# EAGLE schematic Instruments (EAGLE 9.2.2)
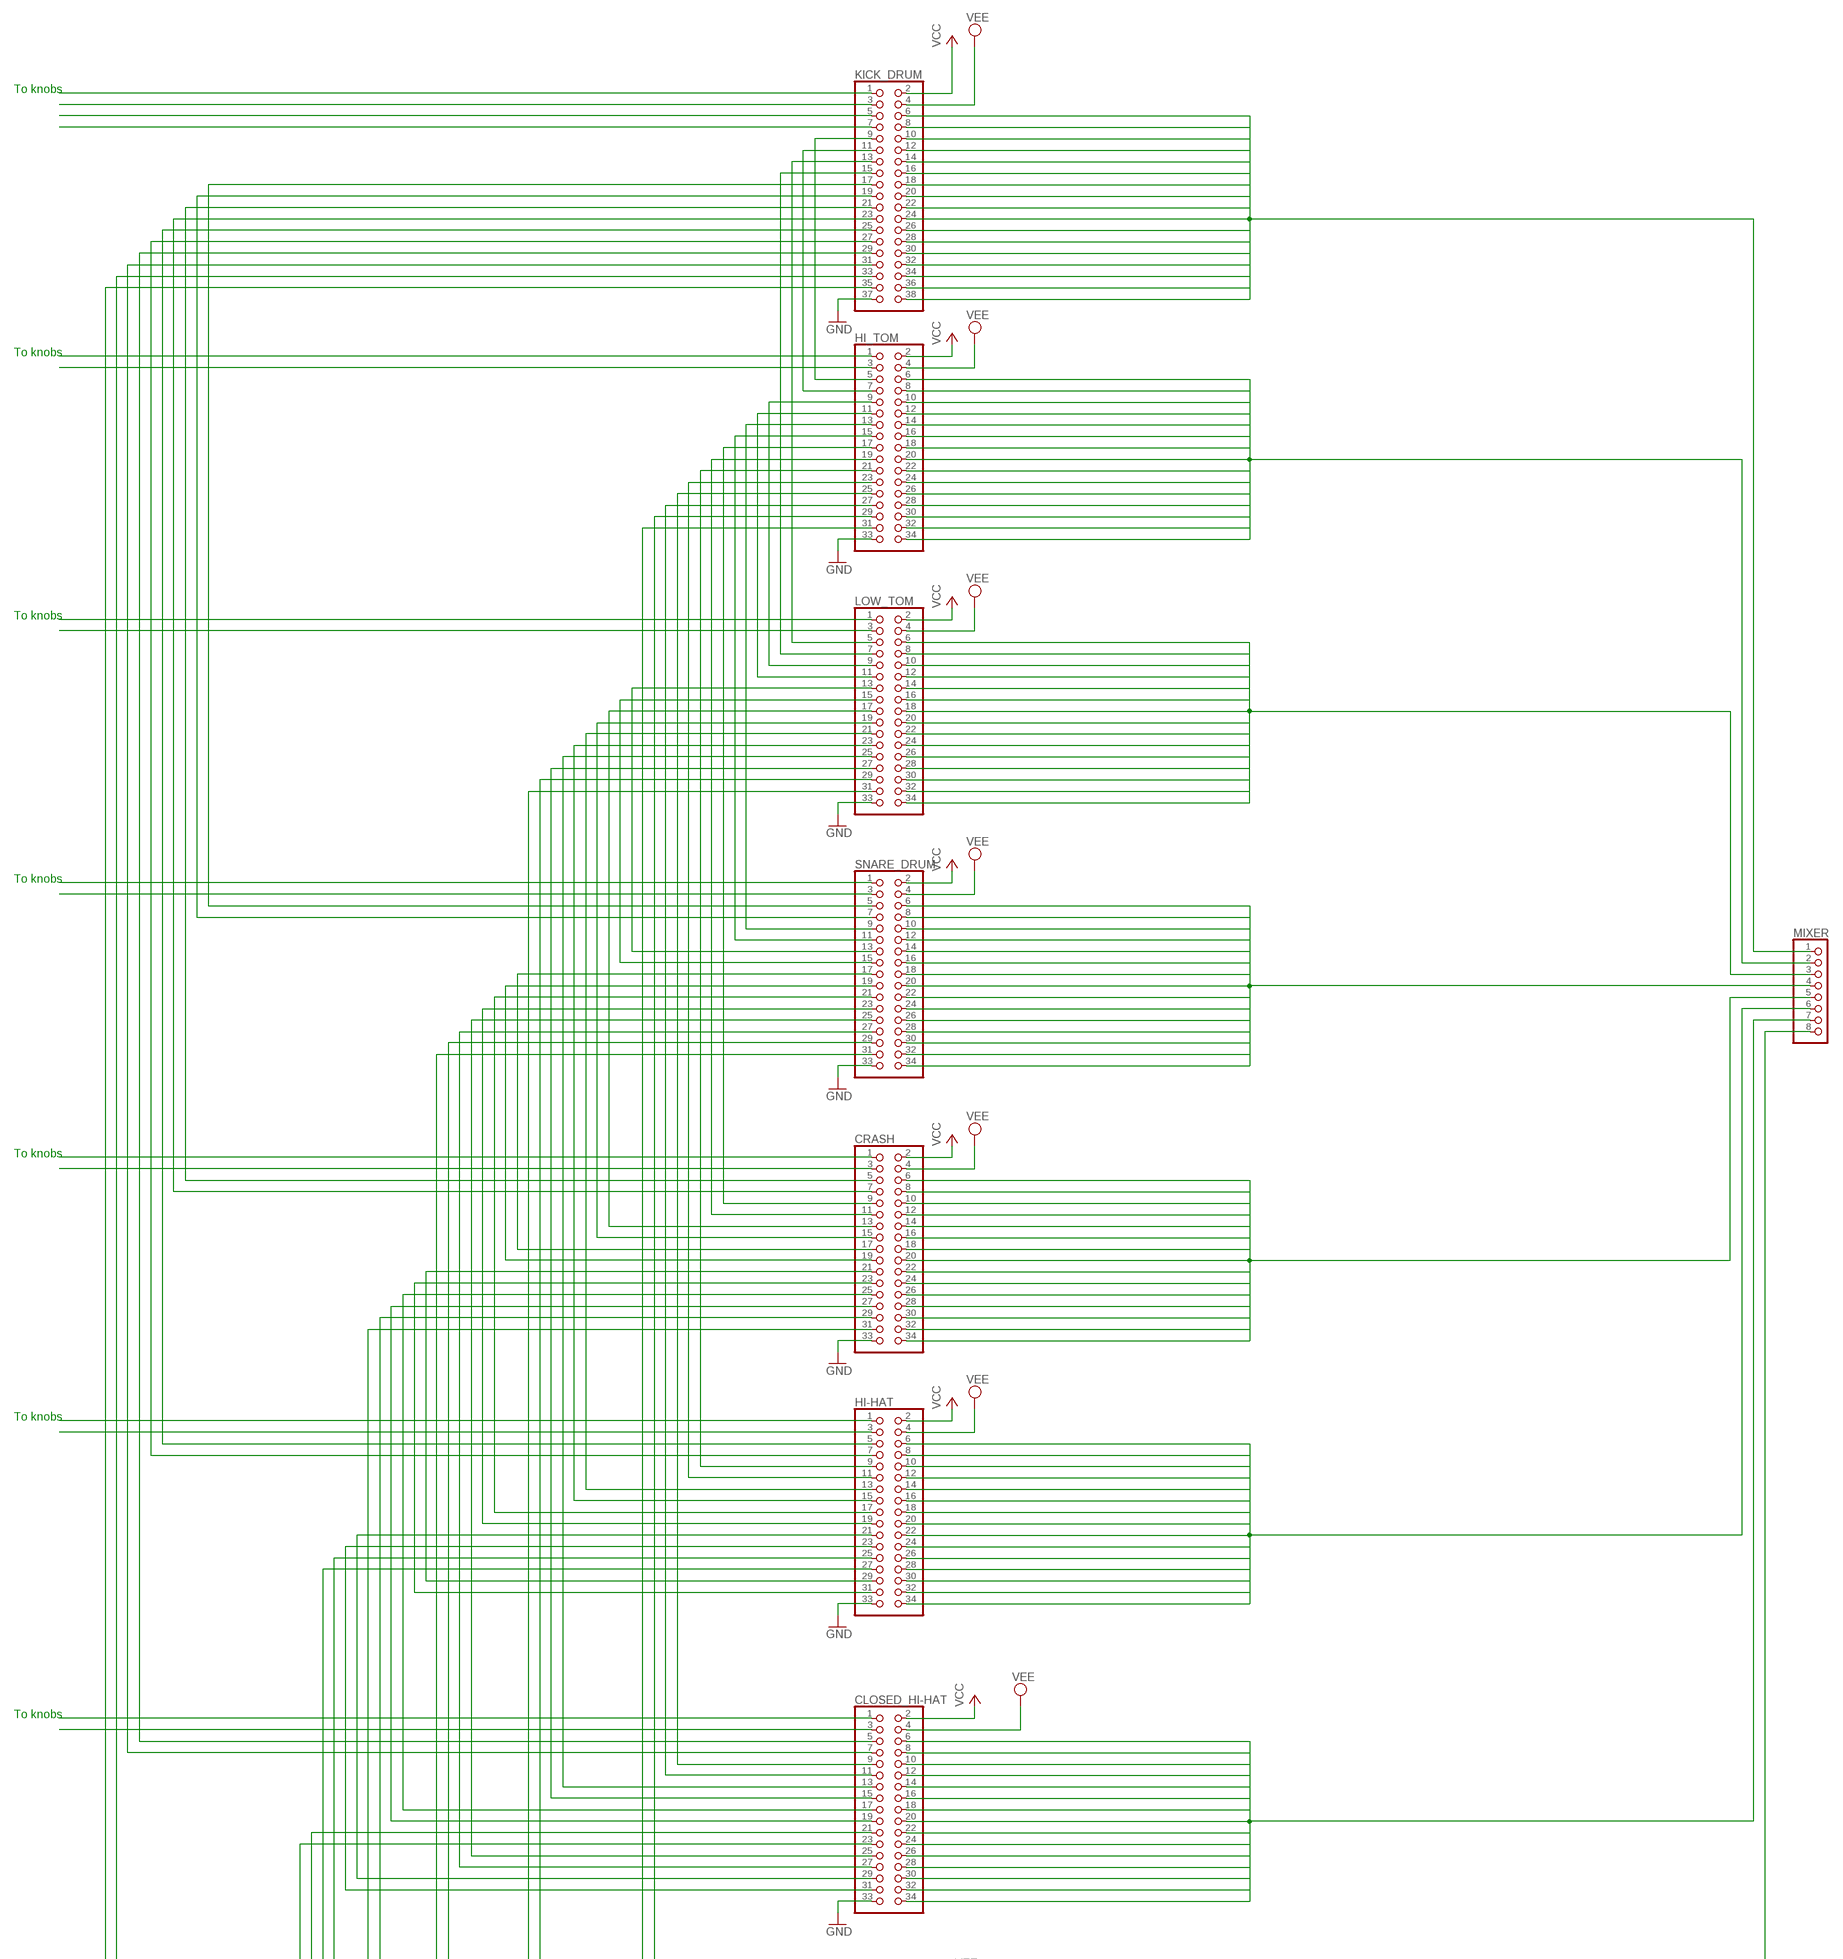
[diagram p0: schematic, sheet 1, part 1 of 2]
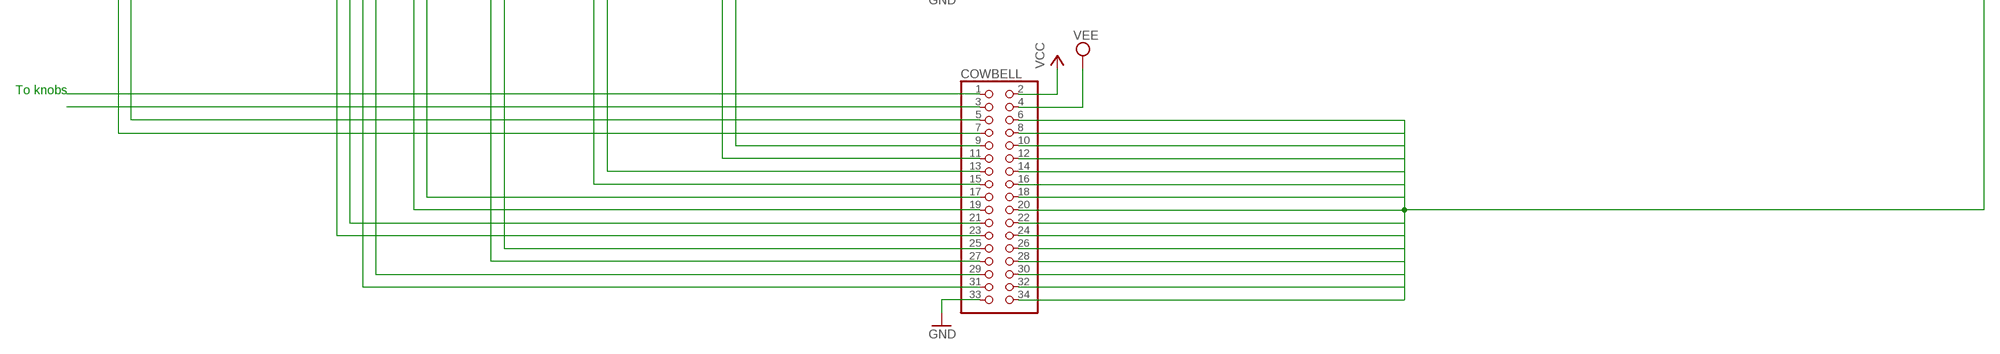
[diagram p1: schematic, sheet 1, part 2 of 2]

## Parts
CLOSED_HI-HAT  PINHD-2X17  [2X17]
COWBELL  PINHD-2X17  [2X17]
CRASH  PINHD-2X17  [2X17]
HI-HAT  PINHD-2X17  [2X17]
HI_TOM  PINHD-2X17  [2X17]
KICK_DRUM  PINHD-2X19  [2X19]
LOW_TOM  PINHD-2X17  [2X17]
MIXER  PINHD-1X8  [1X08]
SNARE_DRUM  PINHD-2X17  [2X17]

## Nets
GND: CLOSED_HI-HAT.33 COWBELL.33 CRASH.33 HI-HAT.33 HI_TOM.33 KICK_DRUM.37 LOW_TOM.33 SNARE_DRUM.33
N$1: KICK_DRUM.7
N$2: HI_TOM.9 LOW_TOM.9
N$3: HI_TOM.11 LOW_TOM.11
N$4: KICK_DRUM.3
N$5: KICK_DRUM.5
N$6: KICK_DRUM.1
N$7: HI_TOM.5 KICK_DRUM.9
N$8: HI_TOM.7 KICK_DRUM.11
N$9: LOW_TOM.1
N$10: LOW_TOM.3
N$11: SNARE_DRUM.1
N$12: SNARE_DRUM.3
N$13: CRASH.1
N$14: CRASH.3
N$15: HI_TOM.13 SNARE_DRUM.9
N$16: HI_TOM.15 SNARE_DRUM.11
N$17: KICK_DRUM.13 LOW_TOM.5
N$18: KICK_DRUM.15 LOW_TOM.7
N$19: KICK_DRUM.17 SNARE_DRUM.5
N$20: KICK_DRUM.19 SNARE_DRUM.7
N$21: CRASH.5 KICK_DRUM.21
N$22: CRASH.7 KICK_DRUM.23
N$23: HI-HAT.5 KICK_DRUM.25
N$24: HI-HAT.7 KICK_DRUM.27
N$25: CLOSED_HI-HAT.5 KICK_DRUM.29
N$26: CLOSED_HI-HAT.7 KICK_DRUM.31
N$27: CLOSED_HI-HAT.1
N$28: CLOSED_HI-HAT.3
N$29: COWBELL.1
N$30: COWBELL.3
N$31: COWBELL.5 KICK_DRUM.33
N$32: COWBELL.7 KICK_DRUM.35
N$33: CRASH.9 HI_TOM.17
N$34: CRASH.11 HI_TOM.19
N$35: HI-HAT.9 HI_TOM.21
N$36: HI-HAT.11 HI_TOM.23
N$37: HI-HAT.1
N$38: HI-HAT.3
N$39: CLOSED_HI-HAT.9 HI_TOM.25
N$40: CLOSED_HI-HAT.11 HI_TOM.27
N$41: COWBELL.9 HI_TOM.29
N$42: COWBELL.11 HI_TOM.31
N$43: LOW_TOM.13 SNARE_DRUM.13
N$44: LOW_TOM.15 SNARE_DRUM.15
N$45: CRASH.13 LOW_TOM.17
N$46: HI_TOM.1
N$47: HI_TOM.3
N$48: CRASH.15 LOW_TOM.19
N$49: HI-HAT.13 LOW_TOM.21
N$50: HI-HAT.15 LOW_TOM.23
N$51: CLOSED_HI-HAT.13 LOW_TOM.25
N$52: CLOSED_HI-HAT.15 LOW_TOM.27
N$53: COWBELL.13 LOW_TOM.29
N$54: COWBELL.15 LOW_TOM.31
N$55: CRASH.17 SNARE_DRUM.17
N$56: CRASH.19 SNARE_DRUM.19
N$57: HI-HAT.17 SNARE_DRUM.21
N$58: HI-HAT.19 SNARE_DRUM.23
N$59: CLOSED_HI-HAT.25 SNARE_DRUM.25
N$60: CLOSED_HI-HAT.27 SNARE_DRUM.27
N$61: COWBELL.25 SNARE_DRUM.29
N$62: CRASH.21 HI-HAT.29
N$63: COWBELL.27 SNARE_DRUM.31
N$64: CRASH.23 HI-HAT.31
N$65: CLOSED_HI-HAT.17 CRASH.25
N$66: CLOSED_HI-HAT.19 CRASH.27
N$67: COWBELL.17 CRASH.29
N$68: COWBELL.19 CRASH.31
N$69: CLOSED_HI-HAT.21 COWBELL.21
N$70: CLOSED_HI-HAT.23 COWBELL.23
N$71: KICK_DRUM.6 KICK_DRUM.24 KICK_DRUM.38 MIXER.1
N$72: KICK_DRUM.8
N$73: CLOSED_HI-HAT.29 HI-HAT.21
N$74: CLOSED_HI-HAT.31 HI-HAT.23
N$75: COWBELL.29 HI-HAT.25
N$76: COWBELL.31 HI-HAT.27
N$77: KICK_DRUM.10
N$78: KICK_DRUM.12
N$79: KICK_DRUM.14
N$80: KICK_DRUM.16
N$81: KICK_DRUM.18
N$82: KICK_DRUM.20
N$83: KICK_DRUM.22
N$85: KICK_DRUM.26
N$86: KICK_DRUM.28
N$87: KICK_DRUM.30
N$88: KICK_DRUM.32
N$89: KICK_DRUM.34
N$90: KICK_DRUM.36
N$92: HI_TOM.6 HI_TOM.34 MIXER.2
N$93: HI_TOM.8
N$94: HI_TOM.10
N$95: HI_TOM.12
N$96: HI_TOM.14
N$97: HI_TOM.16
N$98: HI_TOM.18
N$99: HI_TOM.20
N$100: HI_TOM.22
N$101: HI_TOM.24
N$102: HI_TOM.26
N$103: HI_TOM.28
N$104: HI_TOM.30
N$105: HI_TOM.32
N$108: LOW_TOM.8
N$109: LOW_TOM.10
N$110: LOW_TOM.12
N$111: LOW_TOM.14
N$112: LOW_TOM.16
N$113: LOW_TOM.6 LOW_TOM.18 LOW_TOM.34 MIXER.3
N$114: LOW_TOM.20
N$115: LOW_TOM.22
N$116: LOW_TOM.24
N$117: LOW_TOM.26
N$118: LOW_TOM.28
N$119: LOW_TOM.30
N$120: LOW_TOM.32
N$122: MIXER.4 SNARE_DRUM.6 SNARE_DRUM.20 SNARE_DRUM.34
N$123: SNARE_DRUM.8
N$124: SNARE_DRUM.10
N$125: SNARE_DRUM.12
N$126: SNARE_DRUM.14
N$127: SNARE_DRUM.16
N$128: SNARE_DRUM.18
N$130: SNARE_DRUM.22
N$131: SNARE_DRUM.24
N$132: SNARE_DRUM.26
N$133: SNARE_DRUM.28
N$134: SNARE_DRUM.30
N$135: SNARE_DRUM.32
N$137: CRASH.6 CRASH.34 MIXER.5
N$138: CRASH.8
N$139: CRASH.10
N$140: CRASH.12
N$141: CRASH.14
N$142: CRASH.16
N$143: CRASH.18
N$144: CRASH.20
N$145: CRASH.22
N$146: CRASH.24
N$147: CRASH.26
N$148: CRASH.28
N$149: CRASH.30
N$150: CRASH.32
N$152: HI-HAT.6 HI-HAT.34 MIXER.6
N$153: HI-HAT.8
N$154: HI-HAT.10
N$155: HI-HAT.12
N$156: HI-HAT.14
N$157: HI-HAT.16
N$158: HI-HAT.18
N$159: HI-HAT.20
N$160: HI-HAT.22
N$161: HI-HAT.24
N$162: HI-HAT.26
N$163: HI-HAT.28
N$164: HI-HAT.30
N$165: HI-HAT.32
N$167: CLOSED_HI-HAT.6 CLOSED_HI-HAT.34 MIXER.7
N$168: CLOSED_HI-HAT.8
N$169: CLOSED_HI-HAT.10
N$170: CLOSED_HI-HAT.12
N$171: CLOSED_HI-HAT.14
N$172: CLOSED_HI-HAT.16
N$173: CLOSED_HI-HAT.18
N$174: CLOSED_HI-HAT.20
N$175: CLOSED_HI-HAT.22
N$176: CLOSED_HI-HAT.24
N$177: CLOSED_HI-HAT.26
N$178: CLOSED_HI-HAT.28
N$179: CLOSED_HI-HAT.30
N$180: CLOSED_HI-HAT.32
N$182: COWBELL.6 COWBELL.20 COWBELL.34 MIXER.8
N$183: COWBELL.8
N$184: COWBELL.10
N$185: COWBELL.12
N$186: COWBELL.14
N$187: COWBELL.16
N$188: COWBELL.18
N$190: COWBELL.22
N$191: COWBELL.24
N$192: COWBELL.26
N$193: COWBELL.28
N$194: COWBELL.30
N$195: COWBELL.32
VCC: CLOSED_HI-HAT.2 COWBELL.2 CRASH.2 HI-HAT.2 HI_TOM.2 KICK_DRUM.2 LOW_TOM.2 SNARE_DRUM.2
VEE: CLOSED_HI-HAT.4 COWBELL.4 CRASH.4 HI-HAT.4 HI_TOM.4 KICK_DRUM.4 LOW_TOM.4 SNARE_DRUM.4

## Notes on the sheet
- To knobs
- To knobs
- To knobs
- To knobs
- To knobs
- To knobs
- To knobs
- To knobs

## Library data of the parts
CLOSED_HI-HAT COWBELL CRASH HI-HAT HI_TOM LOW_TOM SNARE_DRUM = pinhead:PINHD-2X17: PIN HEADER
KICK_DRUM = pinhead:PINHD-2X19: PIN HEADER
MIXER = pinhead:PINHD-1X8: PIN HEADER